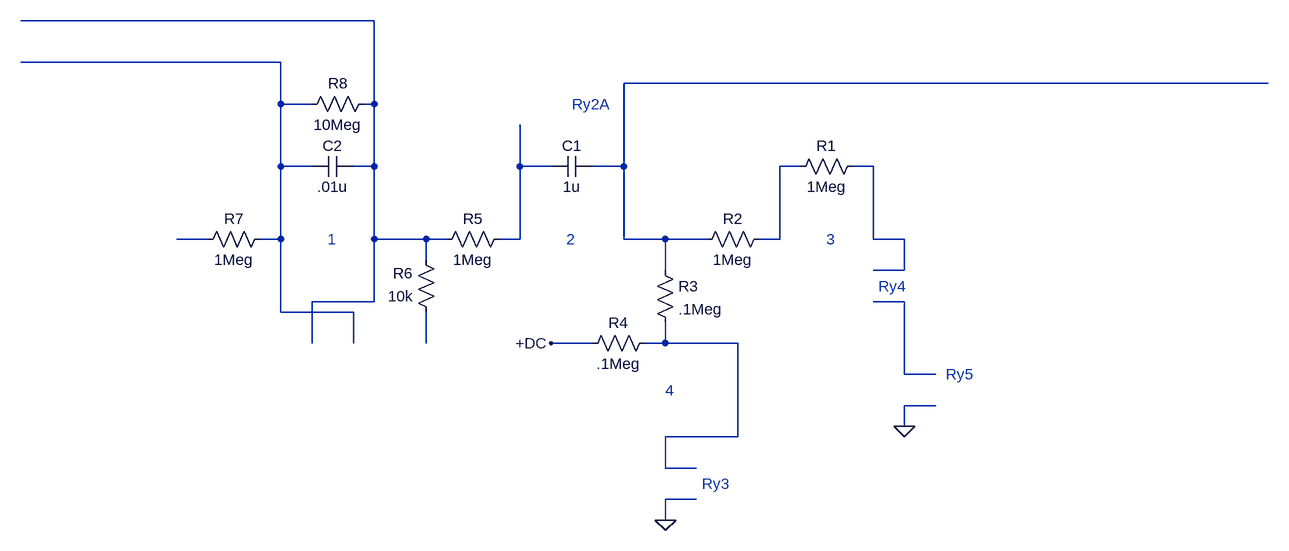
[diagram p0: schematic T42 AnalogComputer.asc]
T42 AnalogComputer.asc, the LTspice schematic file:
Version 4
SHEET 1 1268 680
WIRE -112 -224 -656 -224
WIRE -256 -160 -656 -160
WIRE 1264 -128 272 -128
WIRE -256 -96 -256 -160
WIRE -208 -96 -256 -96
WIRE -112 -96 -112 -224
WIRE -112 -96 -128 -96
WIRE -256 0 -256 -96
WIRE -208 0 -256 0
WIRE -112 0 -112 -96
WIRE -112 0 -144 0
WIRE 112 0 112 -64
WIRE 160 0 112 0
WIRE 272 0 272 -128
WIRE 272 0 224 0
WIRE 544 0 512 0
WIRE 656 0 624 0
WIRE -368 112 -416 112
WIRE -256 112 -256 0
WIRE -256 112 -288 112
WIRE -112 112 -112 0
WIRE -32 112 -112 112
WIRE 0 112 -32 112
WIRE 112 112 112 0
WIRE 112 112 80 112
WIRE 272 112 272 0
WIRE 336 112 272 112
WIRE 400 112 336 112
WIRE 512 112 512 0
WIRE 512 112 480 112
WIRE 656 112 656 0
WIRE 704 112 656 112
WIRE -32 144 -32 112
WIRE 336 160 336 112
WIRE 704 160 704 112
WIRE 704 160 656 160
WIRE -112 208 -112 112
WIRE -112 208 -208 208
WIRE 704 208 656 208
WIRE -256 224 -256 112
WIRE -144 224 -256 224
WIRE -208 272 -208 208
WIRE -144 272 -144 224
WIRE -32 272 -32 224
WIRE 224 272 160 272
WIRE 336 272 336 240
WIRE 336 272 304 272
WIRE 448 272 336 272
WIRE 704 320 704 208
WIRE 752 320 704 320
WIRE 752 368 704 368
WIRE 704 400 704 368
WIRE 448 416 448 272
WIRE 448 416 336 416
WIRE 336 464 336 416
WIRE 384 464 336 464
WIRE 384 512 336 512
WIRE 336 544 336 512
FLAG 704 400 0
FLAG 336 544 0
FLAG 160 272 +DC
SYMBOL res 640 -16 R90
WINDOW 0 0 56 VBottom 2
WINDOW 3 32 56 VTop 2
SYMATTR InstName R1
SYMATTR Value 1Meg
SYMBOL res 496 96 R90
WINDOW 0 0 56 VBottom 2
WINDOW 3 32 56 VTop 2
SYMATTR InstName R2
SYMATTR Value 1Meg
SYMBOL cap 224 -16 R90
WINDOW 0 0 32 VBottom 2
WINDOW 3 32 32 VTop 2
SYMATTR InstName C1
SYMATTR Value 1u
SYMBOL res 320 144 R0
SYMATTR InstName R3
SYMATTR Value .1Meg
SYMBOL res 320 256 R90
WINDOW 0 0 56 VBottom 2
WINDOW 3 32 56 VTop 2
SYMATTR InstName R4
SYMATTR Value .1Meg
SYMBOL res 96 96 R90
WINDOW 0 0 56 VBottom 2
WINDOW 3 32 56 VTop 2
SYMATTR InstName R5
SYMATTR Value 1Meg
SYMBOL res -16 240 R180
WINDOW 0 36 76 Left 2
WINDOW 3 36 40 Left 2
SYMATTR InstName R6
SYMATTR Value 10k
SYMBOL res -272 96 R90
WINDOW 0 0 56 VBottom 2
WINDOW 3 32 56 VTop 2
SYMATTR InstName R7
SYMATTR Value 1Meg
SYMBOL cap -144 -16 R90
WINDOW 0 0 32 VBottom 2
WINDOW 3 32 32 VTop 2
SYMATTR InstName C2
SYMATTR Value .01u
SYMBOL res -112 -112 R90
WINDOW 0 0 56 VBottom 2
WINDOW 3 32 56 VTop 2
SYMATTR InstName R8
SYMATTR Value 10Meg
TEXT 192 -96 Left 2 ;Ry2A
TEXT 768 320 Left 2 ;Ry5
TEXT 664 184 Left 2 ;Ry4
TEXT 584 112 Left 2 ;3
TEXT 336 344 Left 2 ;4
TEXT 392 488 Left 2 ;Ry3
TEXT 184 112 Left 2 ;2
TEXT -184 112 Left 2 ;1

The netlist it stands for:
* T42 AnalogComputer.asc
R1 N006 N005 1Meg
R2 N005 N003 1Meg
C1 N003 N004 1u
R3 N003 N010 .1Meg
R4 N010 +DC .1Meg
R5 N004 N001 1Meg
R6 N009 N001 10k
R7 N002 N007 1Meg
C2 N001 N002 .01u
R8 N001 N002 10Meg
* Ry2A
* Ry5
* Ry4
* 3
* 4
* Ry3
* 2
* 1
.backanno
.end